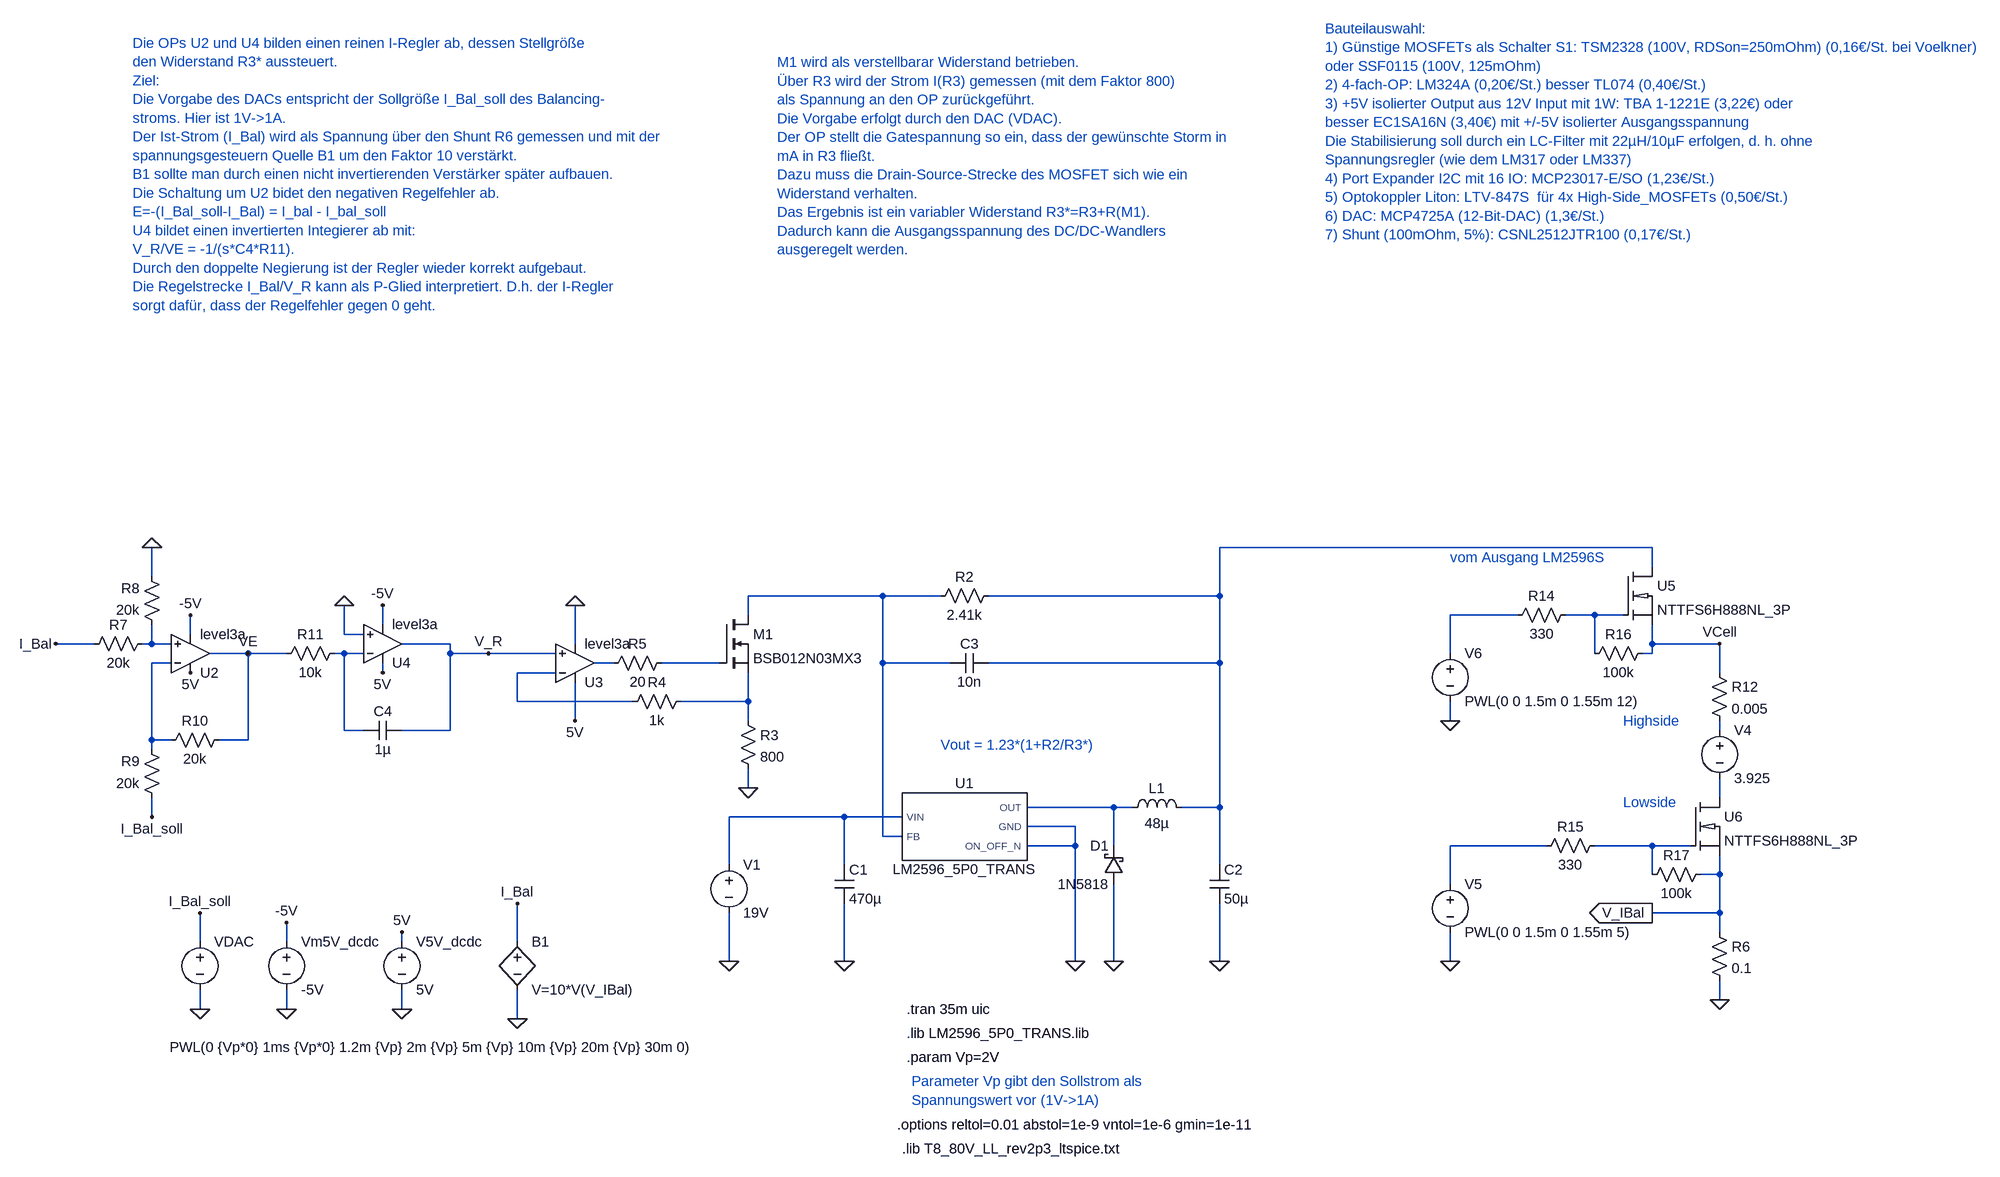
[diagram p0: schematic mosfet ersetzen zweiter versuch.asc]
mosfet ersetzen zweiter versuch.asc, the LTspice schematic file:
Version 4.1
SHEET 1 2392 860
WIRE 1328 -320 608 -320
WIRE 1328 -288 1328 -320
WIRE -1168 -272 -1168 -320
WIRE 48 -240 -176 -240
WIRE 144 -240 48 -240
WIRE 608 -240 608 -320
WIRE 608 -240 224 -240
WIRE -176 -208 -176 -240
WIRE 1104 -208 992 -208
WIRE 1232 -208 1184 -208
WIRE 1280 -208 1232 -208
WIRE -784 -192 -784 -224
WIRE -1104 -176 -1104 -208
WIRE -848 -176 -848 -224
WIRE -816 -176 -848 -176
WIRE -1264 -160 -1328 -160
WIRE -1168 -160 -1168 -192
WIRE -1168 -160 -1184 -160
WIRE -1136 -160 -1168 -160
WIRE -672 -160 -752 -160
WIRE -464 -160 -464 -224
WIRE 1328 -160 1328 -192
WIRE 1440 -160 1328 -160
WIRE -1008 -144 -1072 -144
WIRE -944 -144 -1008 -144
WIRE -848 -144 -864 -144
WIRE -816 -144 -848 -144
WIRE -672 -144 -672 -160
WIRE -608 -144 -672 -144
WIRE -496 -144 -608 -144
WIRE 992 -144 992 -208
WIRE 1232 -144 1232 -208
WIRE 1328 -144 1328 -160
WIRE 1328 -144 1312 -144
WIRE -1136 -128 -1168 -128
WIRE -400 -128 -432 -128
WIRE -224 -128 -320 -128
WIRE 48 -128 48 -240
WIRE 160 -128 48 -128
WIRE 608 -128 608 -240
WIRE 608 -128 224 -128
WIRE -784 -112 -784 -128
WIRE -496 -112 -560 -112
WIRE 1440 -112 1440 -160
WIRE -560 -64 -560 -112
WIRE -368 -64 -560 -64
WIRE -176 -64 -176 -112
WIRE -176 -64 -288 -64
WIRE -464 -32 -464 -96
WIRE -176 -32 -176 -64
WIRE 992 -32 992 -64
WIRE -848 -16 -848 -144
WIRE -816 -16 -848 -16
WIRE -672 -16 -672 -144
WIRE -672 -16 -752 -16
WIRE 1440 -16 1440 -32
WIRE -1168 0 -1168 -128
WIRE -1136 0 -1168 0
WIRE -1008 0 -1008 -144
WIRE -1008 0 -1056 0
WIRE -1168 16 -1168 0
WIRE -176 80 -176 48
WIRE 1440 96 1440 64
WIRE 432 112 288 112
WIRE 464 112 432 112
WIRE 608 112 608 -128
WIRE 608 112 544 112
WIRE -1168 128 -1168 96
WIRE -16 128 -208 128
WIRE 80 128 -16 128
WIRE 368 144 288 144
WIRE 48 160 48 -128
WIRE 80 160 48 160
WIRE 368 176 368 144
WIRE 368 176 288 176
WIRE 432 176 432 112
WIRE 1152 176 992 176
WIRE 1328 176 1232 176
WIRE 1392 176 1328 176
WIRE -208 208 -208 128
WIRE -16 208 -16 128
WIRE 608 208 608 112
WIRE 1328 224 1328 176
WIRE 1440 224 1440 192
WIRE 1440 224 1408 224
WIRE 992 240 992 176
WIRE 1440 288 1440 224
WIRE 1440 288 1328 288
WIRE 1440 320 1440 288
WIRE -1088 336 -1088 288
WIRE -944 336 -944 304
WIRE -752 336 -752 320
WIRE -560 336 -560 272
WIRE -208 368 -208 288
WIRE -16 368 -16 272
WIRE 368 368 368 176
WIRE 432 368 432 240
WIRE 608 368 608 272
WIRE 992 368 992 320
WIRE 1440 432 1440 400
WIRE -1088 448 -1088 416
WIRE -944 448 -944 416
WIRE -752 448 -752 416
WIRE -560 464 -560 416
FLAG -208 368 0
FLAG -16 368 0
FLAG 368 368 0
FLAG 608 368 0
FLAG -176 80 0
FLAG 432 368 0
FLAG -1088 448 0
FLAG -464 -224 0
FLAG -752 448 0
FLAG -1088 288 I_Bal_soll
FLAG -752 320 5V
FLAG -464 -32 5V
FLAG -1168 -320 0
FLAG -560 464 0
FLAG -560 272 I_Bal
FLAG -1328 -160 I_Bal
FLAG -1104 -112 5V
FLAG -944 448 0
FLAG -944 304 -5V
FLAG -1104 -208 -5V
FLAG -784 -112 5V
FLAG -784 -224 -5V
FLAG -1168 128 I_Bal_soll
FLAG -1008 -144 VE
FLAG -608 -144 V_R
FLAG -848 -224 0
FLAG 1440 432 0
FLAG 1440 -160 VCell
FLAG 992 368 0
FLAG 1328 288 V_IBal
IOPIN 1328 288 Out
FLAG 992 -32 0
SYMBOL voltage -208 192 R0
WINDOW 123 0 0 Left 0
WINDOW 39 0 0 Left 0
SYMATTR InstName V1
SYMATTR Value 19V
SYMBOL cap -32 208 R0
SYMATTR InstName C1
SYMATTR Value 470µ
SYMBOL ind 448 128 R270
WINDOW 0 32 56 VTop 2
WINDOW 3 5 56 VBottom 2
SYMATTR InstName L1
SYMATTR Value 48µ
SYMATTR SpiceLine Rser=1m
SYMBOL cap 592 208 R0
SYMATTR InstName C2
SYMATTR Value 50µ
SYMBOL res 240 -256 R90
WINDOW 0 0 56 VBottom 2
WINDOW 3 32 56 VTop 2
SYMATTR InstName R2
SYMATTR Value 2.41k
SYMBOL res -192 -48 R0
SYMATTR InstName R3
SYMATTR Value 800
SYMBOL schottky 448 240 R180
WINDOW 0 24 64 Left 2
WINDOW 3 24 0 Left 2
SYMATTR InstName D1
SYMATTR Value 1N5818
SYMATTR Description Diode
SYMATTR Type diode
SYMBOL LM2596_5P0_TRANS 176 144 R0
SYMATTR InstName U1
SYMBOL nmos -224 -208 R0
SYMATTR InstName M1
SYMATTR Value BSB012N03MX3
SYMBOL voltage -1088 320 R0
WINDOW 3 -50 191 Left 2
WINDOW 123 0 0 Left 0
WINDOW 39 0 0 Left 0
SYMATTR Value PWL(0 {Vp*0} 1ms {Vp*0} 1.2m {Vp} 2m {Vp} 5m {Vp} 10m {Vp} 20m {Vp} 30m 0)
SYMATTR InstName VDAC
SYMBOL voltage -752 320 R0
WINDOW 123 0 0 Left 0
WINDOW 39 0 0 Left 0
SYMATTR InstName V5V_dcdc
SYMATTR Value 5V
SYMBOL res -384 -48 R270
WINDOW 0 32 56 VTop 2
WINDOW 3 0 56 VBottom 2
SYMATTR InstName R4
SYMATTR Value 1k
SYMBOL res -304 -144 R90
WINDOW 0 0 56 VBottom 2
WINDOW 3 32 56 VTop 2
SYMATTR InstName R5
SYMATTR Value 20
SYMBOL cap 224 -144 R90
WINDOW 0 0 32 VBottom 2
WINDOW 3 32 32 VTop 2
SYMATTR InstName C3
SYMATTR Value 10n
SYMBOL OpAmps\\UniversalOpAmp3 -464 -128 M180
SYMATTR InstName U3
SYMBOL OpAmps\\UniversalOpAmp3 -1104 -144 M180
SYMATTR InstName U2
SYMBOL res -1168 -176 R90
WINDOW 0 0 56 VBottom 2
WINDOW 3 32 56 VTop 2
SYMATTR InstName R7
SYMATTR Value 20k
SYMBOL res -1152 -176 R180
WINDOW 0 36 76 Left 2
WINDOW 3 36 40 Left 2
SYMATTR InstName R8
SYMATTR Value 20k
SYMBOL res -1152 112 R180
WINDOW 0 36 76 Left 2
WINDOW 3 36 40 Left 2
SYMATTR InstName R9
SYMATTR Value 20k
SYMBOL res -1152 16 R270
WINDOW 0 32 56 VTop 2
WINDOW 3 0 56 VBottom 2
SYMATTR InstName R10
SYMATTR Value 20k
SYMBOL bv -560 320 R0
SYMATTR InstName B1
SYMATTR Value V=10*V(V_IBal)
SYMBOL voltage -944 320 R0
WINDOW 123 0 0 Left 0
WINDOW 39 0 0 Left 0
SYMATTR InstName Vm5V_dcdc
SYMATTR Value -5V
SYMBOL OpAmps\\UniversalOpAmp3 -784 -160 M180
SYMATTR InstName U4
SYMBOL cap -752 -32 R90
WINDOW 0 0 32 VBottom 2
WINDOW 3 32 32 VTop 2
SYMATTR InstName C4
SYMATTR Value 1µ
SYMBOL res -848 -160 R90
WINDOW 0 0 56 VBottom 2
WINDOW 3 32 56 VTop 2
SYMATTR InstName R11
SYMATTR Value 10k
SYMBOL res 1424 -128 R0
SYMATTR InstName R12
SYMATTR Value 0.005
SYMBOL voltage 1440 -32 R0
WINDOW 123 0 0 Left 0
WINDOW 39 0 0 Left 0
SYMATTR InstName V4
SYMATTR Value 3.925
SYMBOL voltage 992 224 R0
WINDOW 123 0 0 Left 0
WINDOW 39 0 0 Left 0
SYMATTR InstName V5
SYMATTR Value PWL(0 0 1.5m 0 1.55m 5)
SYMBOL res 1424 304 R0
SYMATTR InstName R6
SYMATTR Value 0.1
SYMBOL onsemi\ T8\ 80V\ Logic\ Level\ Model\ Library\\NTTFS6H888NL_3P 1280 -288 R0
SYMATTR InstName U5
SYMBOL onsemi\ T8\ 80V\ Logic\ Level\ Model\ Library\\NTTFS6H888NL_3P 1392 96 R0
SYMATTR InstName U6
SYMBOL voltage 992 -160 R0
WINDOW 123 0 0 Left 0
WINDOW 39 0 0 Left 0
SYMATTR InstName V6
SYMATTR Value PWL(0 0 1.5m 0 1.55m 12)
SYMBOL res 1200 -224 R90
WINDOW 0 0 56 VBottom 2
WINDOW 3 32 56 VTop 2
SYMATTR InstName R14
SYMATTR Value 330
SYMBOL res 1248 160 R90
WINDOW 0 0 56 VBottom 2
WINDOW 3 32 56 VTop 2
SYMATTR InstName R15
SYMATTR Value 330
SYMBOL res 1328 -160 R90
WINDOW 0 0 56 VBottom 2
WINDOW 3 32 56 VTop 2
SYMATTR InstName R16
SYMATTR Value 100k
SYMBOL res 1424 208 R90
WINDOW 0 0 56 VBottom 2
WINDOW 3 32 56 VTop 2
SYMATTR InstName R17
SYMATTR Value 100k
TEXT 88 488 Left 2 !.lib LM2596_5P0_TRANS.lib
TEXT 88 448 Left 2 !.tran 35m uic
TEXT 144 8 Left 2 ;Vout = 1.23*(1+R2/R3*)
TEXT -128 -1128 Left 2 ;M1 wird als verstellbarar Widerstand betrieben.\nÜber R3 wird der Strom I(R3) gemessen (mit dem Faktor 800)\nals Spannung an den OP zurückgeführt.\nDie Vorgabe erfolgt durch den DAC (VDAC).\nDer OP stellt die Gatespannung so ein, dass der gewünschte Storm in\nmA in R3 fließt.\nDazu muss die Drain-Source-Strecke des MOSFET sich wie ein \nWiderstand verhalten.\nDas Ergebnis ist ein variabler Widerstand R3*=R3+R(M1).\nDadurch kann die Ausgangsspannung des DC/DC-Wandlers\nausgeregelt werden.
TEXT 88 528 Left 2 !.param Vp=2V
TEXT -1200 -1160 Left 2 ;Die OPs U2 und U4 bilden einen reinen I-Regler ab, dessen Stellgröße \nden Widerstand R3* aussteuert.\nZiel: \nDie Vorgabe des DACs entspricht der Sollgröße I_Bal_soll des Balancing-\nstroms. Hier ist 1V->1A.\nDer Ist-Strom (I_Bal) wird als Spannung über den Shunt R6 gemessen und mit der \nspannungsgesteuern Quelle B1 um den Faktor 10 verstärkt.\nB1 sollte man durch einen nicht invertierenden Verstärker später aufbauen.\nDie Schaltung um U2 bidet den negativen Regelfehler ab.\nE=-(I_Bal_soll-I_Bal) = I_bal - I_bal_soll\nU4 bildet einen invertierten Integierer ab mit:\nV_R/VE = -1/(s*C4*R11). \nDurch den doppelte Negierung ist der Regler wieder korrekt aufgebaut.\nDie Regelstrecke I_Bal/V_R kann als P-Glied interpretiert. D.h. der I-Regler \nsorgt dafür, dass der Regelfehler gegen 0 geht.
TEXT 784 -1184 Left 2 ;Bauteilauswahl:\n1) Günstige MOSFETs als Schalter S1: TSM2328 (100V, RDSon=250mOhm) (0,16€/St. bei Voelkner)\noder SSF0115 (100V, 125mOhm)\n2) 4-fach-OP: LM324A (0,20€/St.) besser TL074 (0,40€/St.)\n3) +5V isolierter Output aus 12V Input mit 1W: TBA 1-1221E (3,22€) oder \nbesser EC1SA16N (3,40€) mit +/-5V isolierter Ausgangsspannung\nDie Stabilisierung soll durch ein LC-Filter mit 22µH/10µF erfolgen, d. h. ohne \nSpannungsregler (wie dem LM317 oder LM337) \n4) Port Expander I2C mit 16 IO: MCP23017-E/SO (1,23€/St.)\n5) Optokoppler Liton: LTV-847S  für 4x High-Side_MOSFETs (0,50€/St.)\n6) DAC: MCP4725A (12-Bit-DAC) (1,3€/St.)\n7) Shunt (100mOhm, 5%): CSNL2512JTR100 (0,17€/St.)
TEXT 96 568 Left 2 ;Parameter Vp gibt den Sollstrom als \nSpannungswert vor (1V->1A)
TEXT 80 680 Left 2 !.lib T8_80V_LL_rev2p3_ltspice.txt
TEXT 72 640 Left 2 !.options reltol=0.01 abstol=1e-9 vntol=1e-6 gmin=1e-11
TEXT 1280 -32 Left 2 ;Highside
TEXT 1280 104 Left 2 ;Lowside
TEXT 992 -304 Left 2 ;vom Ausgang LM2596S

The netlist it stands for:
* mosfet ersetzen zweiter versuch.asc
V1 N015 0 19V
C1 N015 0 470µ
L1 N014 N001 48µ Rser=1m
C2 N001 0 50µ
R2 N001 N002 2.41k
R3 N011 0 800
D1 0 N014 1N5818
X§U1 N015 N002 N014 0 0 LM2596_5P0_TRANS  ; pins VIN FB OUT GND ON_OFF_N
M1 N002 N009 N011 N011 BSB012N03MX3
VDAC I_Bal_soll 0 PWL(0 {Vp*0} 1ms {Vp*0} 1.2m {Vp} 2m {Vp} 5m {Vp} 10m {Vp} 20m {Vp} 30m 0)
V5V_dcdc 5V 0 5V
R4 N010 N011 1k
R5 N009 N008 20
C3 N001 N002 10n
X§U3 V_R N010 5V 0 N008 level3a  ; pins In+ In- V+ V- OUT
X§U2 N005 N007 5V -5V VE level3a  ; pins In+ In- V+ V- OUT
R7 N005 I_Bal 20k
R8 N005 0 20k
R9 I_Bal_soll N007 20k
R10 N007 VE 20k
B1 I_Bal 0 V=10*V(V_IBal)
Vm5V_dcdc -5V 0 -5V
X§U4 0 N006 5V -5V V_R level3a  ; pins In+ In- V+ V- OUT
C4 V_R N006 1µ
R11 N006 VE 10k
R12 VCell N012 0.005
V4 N012 N013 3.925
V5 N016 0 PWL(0 0 1.5m 0 1.55m 5)
R6 V_IBal 0 0.1
X§U5 N001 N004 VCell NTTFS6H888NL_3P  ; pins D G S
X§U6 N013 N017 V_IBal NTTFS6H888NL_3P  ; pins D G S
V6 N003 0 PWL(0 0 1.5m 0 1.55m 12)
R14 N004 N003 330
R15 N017 N016 330
R16 VCell N004 100k
R17 V_IBal N017 100k
.model D D
.lib standard.dio
.model NMOS NMOS
.model PMOS PMOS
.lib standard.mos
.lib LM2596_5P0_TRANS.lib
.tran 35m uic
* Vout = 1.23*(1+R2/R3*)
* M1 wird als verstellbarar Widerstand betrieben.
* Über R3 wird der Strom I(R3) gemessen (mit dem Faktor 800)
* als Spannung an den OP zurückgeführt.
* Die Vorgabe erfolgt durch den DAC (VDAC).
* Der OP stellt die Gatespannung so ein, dass der gewünschte Storm in
* mA in R3 fließt.
* Dazu muss die Drain-Source-Strecke des MOSFET sich wie ein
* Widerstand verhalten.
* Das Ergebnis ist ein variabler Widerstand R3*=R3+R(M1).
* Dadurch kann die Ausgangsspannung des DC/DC-Wandlers
* ausgeregelt werden.
.param Vp=2V
* Die OPs U2 und U4 bilden einen reinen I-Regler ab, dessen Stellgröße
* den Widerstand R3* aussteuert.
* Ziel:
* Die Vorgabe des DACs entspricht der Sollgröße I_Bal_soll des Balancing-
* stroms. Hier ist 1V->1A.
* Der Ist-Strom (I_Bal) wird als Spannung über den Shunt R6 gemessen und mit der
* spannungsgesteuern Quelle B1 um den Faktor 10 verstärkt.
* B1 sollte man durch einen nicht invertierenden Verstärker später aufbauen.
* Die Schaltung um U2 bidet den negativen Regelfehler ab.
* E=-(I_Bal_soll-I_Bal) = I_bal - I_bal_soll
* U4 bildet einen invertierten Integierer ab mit:
* V_R/VE = -1/(s*C4*R11).
* Durch den doppelte Negierung ist der Regler wieder korrekt aufgebaut.
* Die Regelstrecke I_Bal/V_R kann als P-Glied interpretiert. D.h. der I-Regler
* sorgt dafür, dass der Regelfehler gegen 0 geht.
* Bauteilauswahl:
* 1) Günstige MOSFETs als Schalter S1: TSM2328 (100V, RDSon=250mOhm) (0,16€/St. bei Voelkner)
* oder SSF0115 (100V, 125mOhm)
* 2) 4-fach-OP: LM324A (0,20€/St.) besser TL074 (0,40€/St.)
* 3) +5V isolierter Output aus 12V Input mit 1W: TBA 1-1221E (3,22€) oder
* besser EC1SA16N (3,40€) mit +/-5V isolierter Ausgangsspannung
* Die Stabilisierung soll durch ein LC-Filter mit 22µH/10µF erfolgen, d. h. ohne
* Spannungsregler (wie dem LM317 oder LM337)
* 4) Port Expander I2C mit 16 IO: MCP23017-E/SO (1,23€/St.)
* 5) Optokoppler Liton: LTV-847S  für 4x High-Side_MOSFETs (0,50€/St.)
* 6) DAC: MCP4725A (12-Bit-DAC) (1,3€/St.)
* 7) Shunt (100mOhm, 5%): CSNL2512JTR100 (0,17€/St.)
* Parameter Vp gibt den Sollstrom als
* Spannungswert vor (1V->1A)
.lib T8_80V_LL_rev2p3_ltspice.txt
.options reltol=0.01 abstol=1e-9 vntol=1e-6 gmin=1e-11
* Highside
* Lowside
* vom Ausgang LM2596S
.backanno
.end